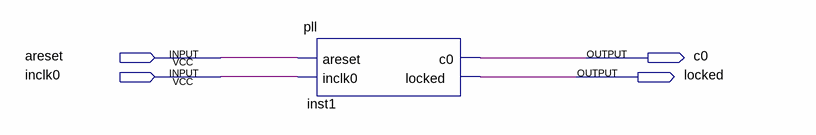
[diagram p0: schematic sheet]
// Quartus schematic LiCy.bdf as structural Verilog: 1 symbols, 4 pins
module LiCy (
  input  areset,
  input  inclk0,
  output c0,
  output locked
);

  pll inst1 (.areset(areset), .inclk0(inclk0), .c0(c0), .locked(locked));
endmodule
